# EAGLE design RGB_controller_2zone_v1.00 (EAGLE 8.1.0)
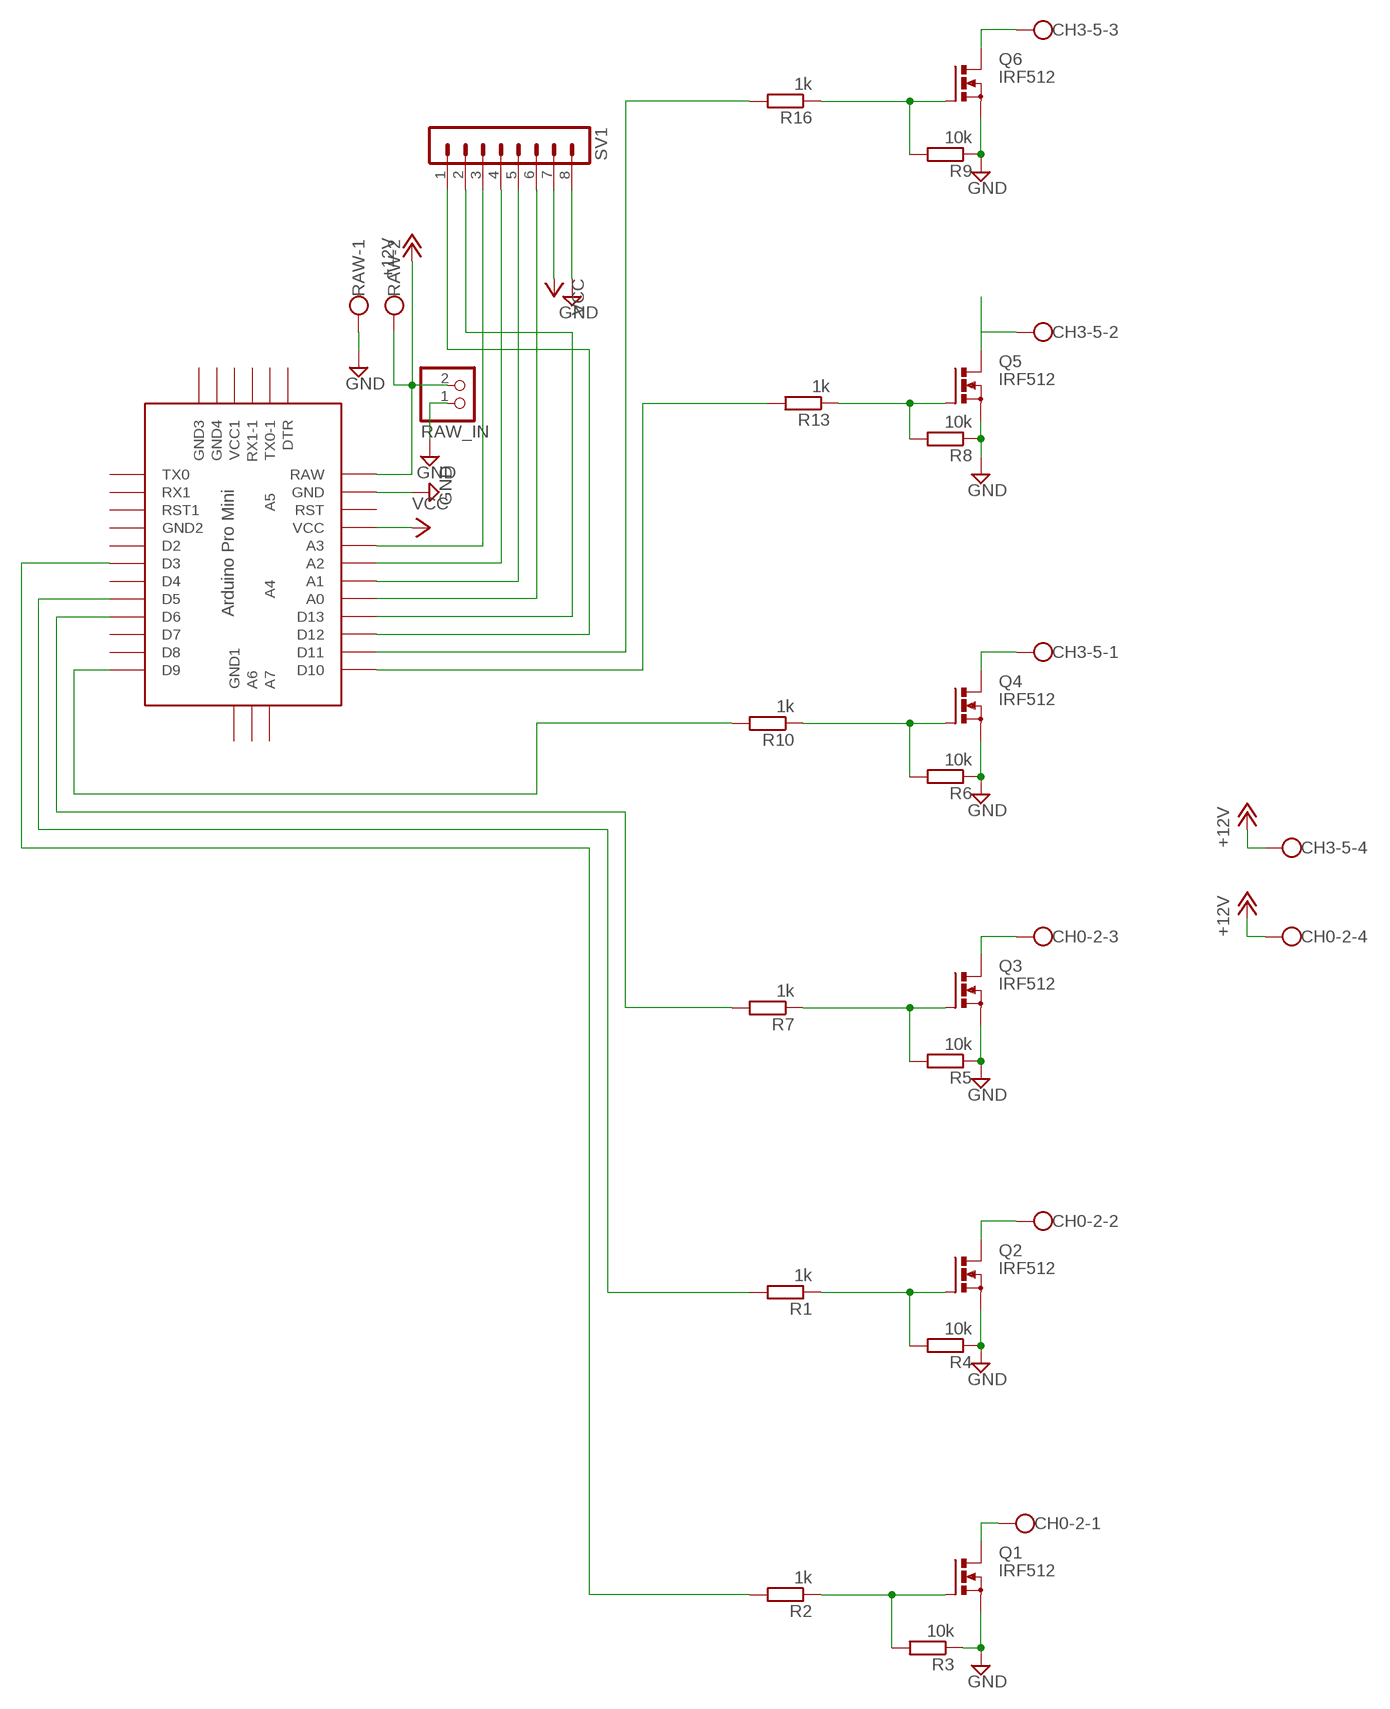
[diagram p0: schematic, sheet 1]

## Parts
CH0-2  W237-4  [W237-4]
CH3-5  W237-4  [W237-4]
Q1  IRF512  [TO220BV]
Q2  IRF512  [TO220BV]
Q3  IRF512  [TO220BV]
Q4  IRF512  [TO220BV]
Q5  IRF512  [TO220BV]
Q6  IRF512  [TO220BV]
R1  1k  R-EU_0207/10  [0207/10]
R2  1k  R-EU_0207/10  [0207/10]
R3  10k  R-EU_0207/10  [0207/10]
R4  10k  R-EU_0207/10  [0207/10]
R5  10k  R-EU_0207/10  [0207/10]
R6  10k  R-EU_0207/10  [0207/10]
R7  1k  R-EU_0207/10  [0207/10]
R8  10k  R-EU_0207/10  [0207/10]
R9  10k  R-EU_0207/10  [0207/10]
R10  1k  R-EU_0207/10  [0207/10]
R13  1k  R-EU_0207/10  [0207/10]
R16  1k  R-EU_0207/10  [0207/10]
RAW  W237-102  [W237-102]
RAW_IN  PINHD-1X2  [1X02]
SV1  MA08-1  [MA08-1]
U$1  ABK-PRO-MINI  [ABK-PRO-MINI]

## Nets
+12V: CH0-2.4 CH3-5.4 RAW.2 RAW_IN.2 U$1.RAW
A0: SV1.6 U$1.A0
A1: SV1.5 U$1.A1
A2: SV1.4 U$1.A2
A3: SV1.3 U$1.A3
D12: SV1.1 U$1.D12
D13: SV1.2 U$1.D13
GATE_1: Q1.G R2.1 R3.2
GATE_2: Q2.G R1.1 R4.2
GATE_3: Q3.G R5.2 R7.1
GATE_4: Q4.G R6.2 R10.1
GATE_5: Q5.G R8.2 R13.1
GATE_6: Q6.G R9.2 R16.1
GND: Q1.S Q2.S Q3.S Q4.S Q5.S Q6.S R3.1 R4.1 R5.1 R6.1 R8.1 R9.1 RAW.1 RAW_IN.1 SV1.8 U$1.GND
IC_PWM_OUT_0: R2.2 U$1.D3
IC_PWM_OUT_1: R1.2 U$1.D5
IC_PWM_OUT_2: R7.2 U$1.D6
IC_PWM_OUT_3: R10.2 U$1.D9
IC_PWM_OUT_4: R13.2 U$1.D10
IC_PWM_OUT_5: R16.2 U$1.D11
OUTPUT_0: CH0-2.1 Q1.D
OUTPUT_1: CH0-2.2 Q2.D
OUTPUT_2: CH0-2.3 Q3.D
OUTPUT_3: CH3-5.1 Q4.D
OUTPUT_4: CH3-5.2 Q5.D
OUTPUT_5: CH3-5.3 Q6.D
VCC: SV1.7 U$1.VCC
Unconnected: U$1.A4 U$1.A5 U$1.A6 U$1.A7 U$1.D2 U$1.D4 U$1.D7 U$1.D8 U$1.DTR U$1.GND1(GND2) U$1.GND2(GND3) U$1.GND3(GND4) U$1.GND4(GND1) U$1.RST U$1.RST1 U$1.RX1 U$1.RX1-1 U$1.TX0 U$1.TX0-1 U$1.VCC1

## Library data of the parts
CH0-2 CH3-5 = con-wago-500:W237-4: WAGO SCREW CLAMP; OC_FARNELL: unknown; OC_NEWARK: unknown
Q1-Q6 = transistor-power:IRF512: N-CHANNEL MOS FET
R1-R10 R13 R16 = rcl:R-EU_: RESISTOR, European symbol
RAW = con-wago-500:W237-102: WAGO SCREW CLAMP; MPN: 237-102; OC_FARNELL: unknown; OC_NEWARK: 70K9898
RAW_IN = pinhead:PINHD-1X2: PIN HEADER
SV1 = con-lstb:MA08-1: PIN HEADER; OC_FARNELL: unknown; OC_NEWARK: unknown
U$1 = Arduino-clone:ABK-PRO-MINI: ABK Pro-Mini Arduino Clone

## Board
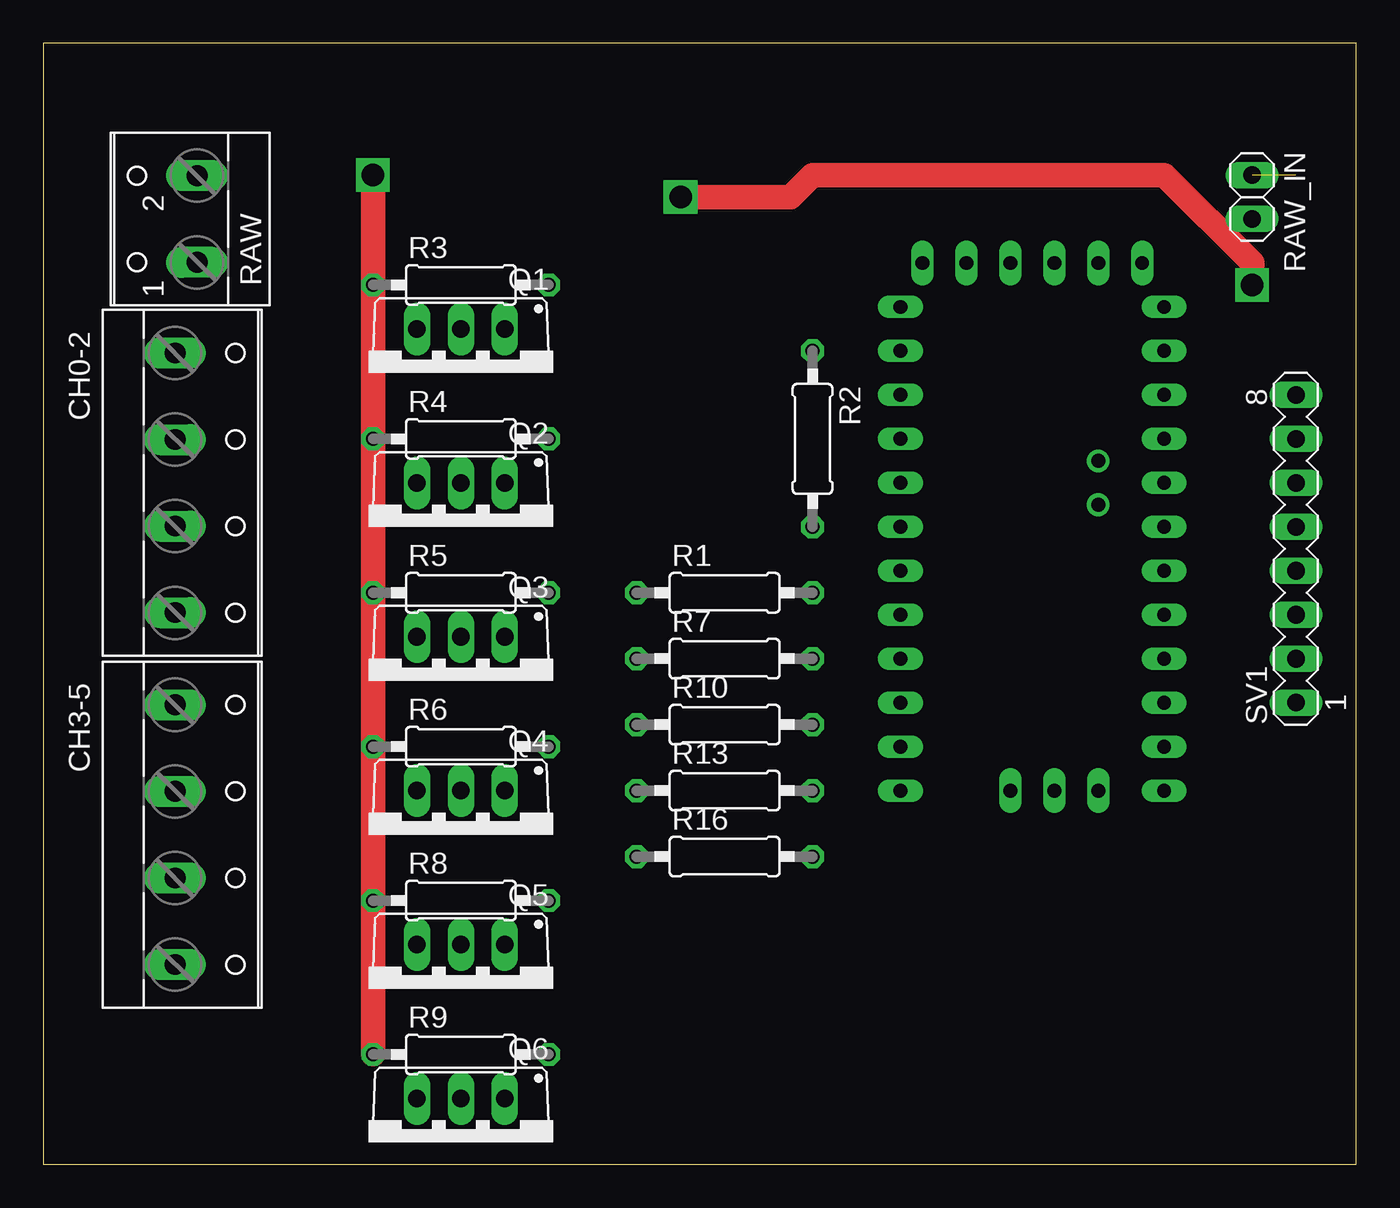
[diagram p1: board, top side]
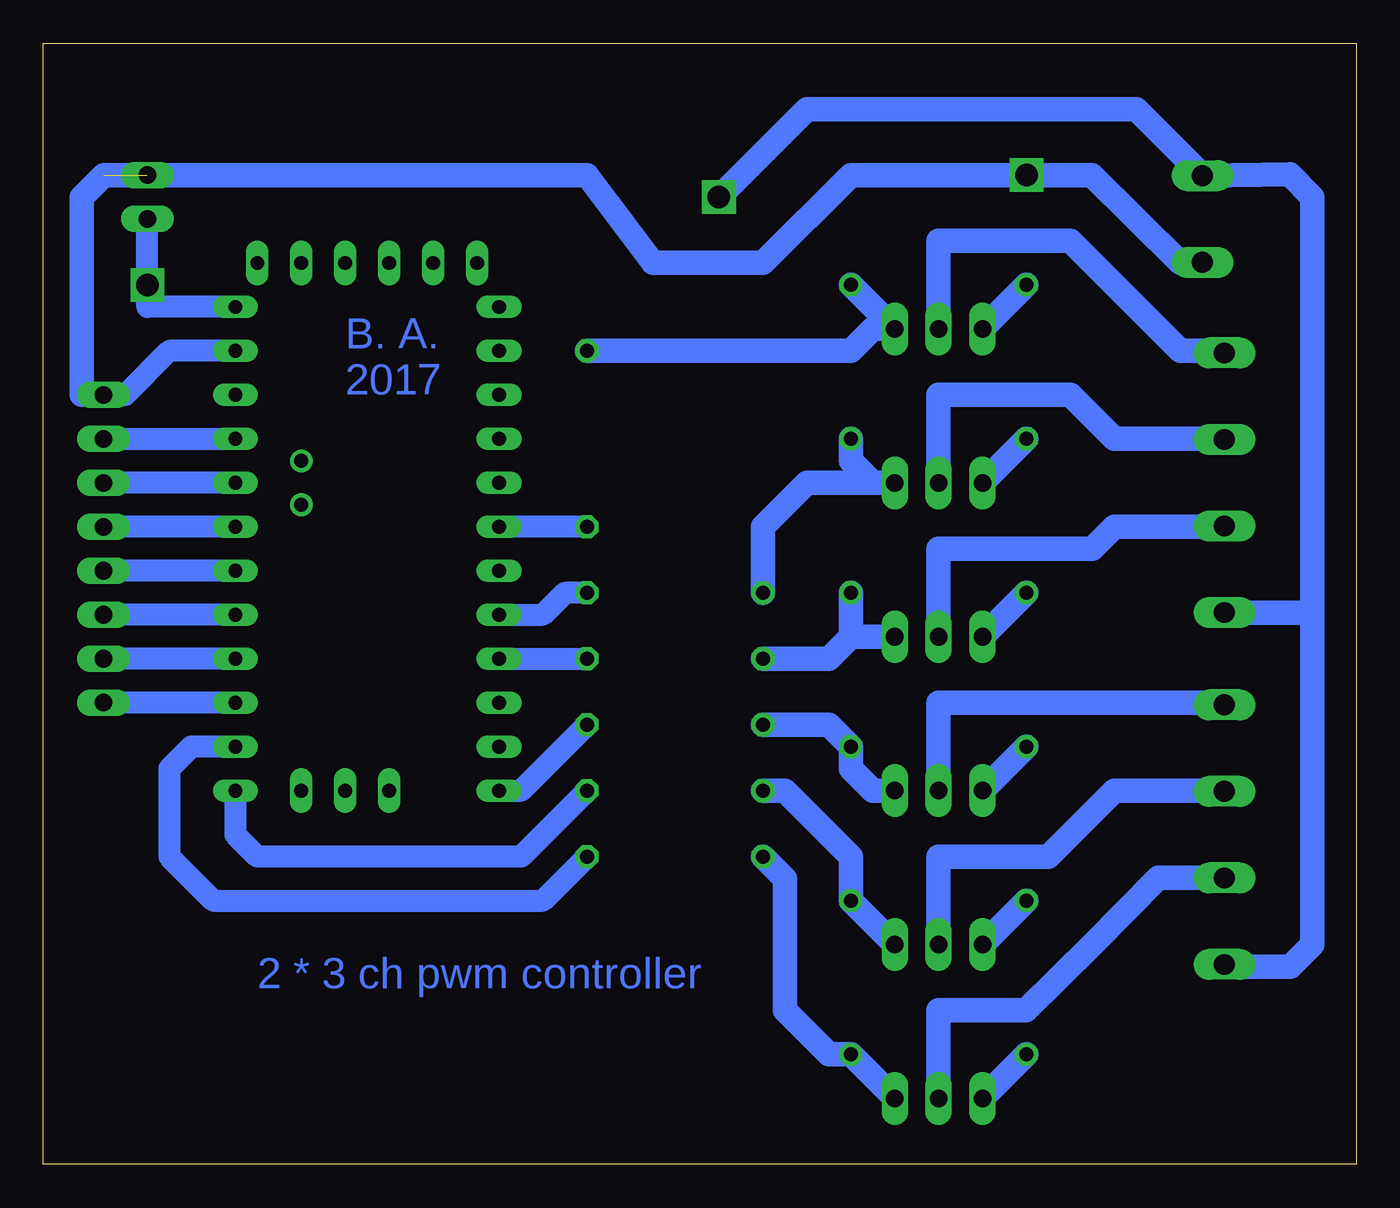
[diagram p2: board, bottom side, seen from below]

Size 75.87 x 64.76 mm. Coordinates in mm from the lower left corner, seen from the top.
Outline: 0,0 75.87,0 75.87,64.76 0,64.76 0,0
Copper layers (1*16): Top 0.035mm / dielectric 1.5mm / Bottom 0.035mm
Design rules "default": minimum track width 10mil, minimum drill 24mil, track to track 8mil, track to pad 8mil, pad to pad 8mil, via to via 8mil, smd to smd 8mil, copper to edge 40mil, drill to drill 8mil, minimum pad ring 10mil, minimum via ring 8mil, stop-mask expansion 4mil, vias tented up to drill 0mil, thermal gap 10mil

### Footprints (pad centres in the part's own frame; a part is rotated, then mirrored left to right if it is on the bottom)
W237-4 = drill 1.194 long: 1 -7.5,-1.27; 2 -2.5,-1.27; 3 2.5,-1.27; 4 7.5,-1.27
TO220BV = drill 1.016 long: D 0,-2.54; G -2.54,-2.54; S 2.54,-2.54
0207/10 = drill 0.813 octagon: 1 -5.08,0; 2 5.08,0
W237-102 = drill 1.194 long: 1 -2.5,-1.27; 2 2.5,-1.27
1X02 = drill 1.016 long: 1 -1.27,0; 2 1.27,0
MA08-1 = drill 1.016 long: 1 -8.89,0; 2 -6.35,0; 3 -3.81,0; 4 -1.27,0; 5 1.27,0; 6 3.81,0; 7 6.35,0; 8 8.89,0
ABK-PRO-MINI = drill 0.8 long: A0 10.16,-3.81; A1 10.16,-6.35; A2 10.16,-8.89; A3 10.16,-11.43; A6 3.81,-21.59; A7 6.35,-21.59; D2 -5.08,-3.81; D3 -5.08,-6.35; D4 -5.08,-8.89; D5 -5.08,-11.43; D6 -5.08,-13.97; D7 -5.08,-16.51; D8 -5.08,-19.05; D9 -5.08,-21.59; D10 10.16,-21.59; D11 10.16,-19.05; D12 10.16,-16.51; D13 10.16,-13.97; DTR 8.89,8.89; GND 10.16,3.81; GND1 -5.08,-1.27; GND2 -3.81,8.89; GND3 -1.27,8.89; GND4 1.27,-21.59; RAW 10.16,6.35; RST 10.16,1.27; RST1 -5.08,1.27; RX1 -5.08,3.81; RX1-1 3.81,8.89; TX0 -5.08,6.35; TX0-1 6.35,8.89; VCC 10.16,-1.27; VCC1 1.27,8.89 | drill 0.8: A4 6.35,-5.08; A5 6.35,-2.54

### Placement (x,y rotation side)
CH0-2  8.89,39.37 270 top
CH3-5  8.89,19.05 270 top
Q1  24.13,45.72 180 top
Q2  24.13,36.83 180 top
Q3  24.13,27.94 180 top
Q4  24.13,19.05 180 top
Q5  24.13,10.16 180 top
Q6  24.13,1.27 180 top
R1  39.37,33.02 0 top
R2  44.45,41.91 270 top
R3  24.13,50.8 0 top
R4  24.13,41.91 0 top
R5  24.13,33.02 0 top
R6  24.13,24.13 0 top
R7  39.37,29.21 0 top
R8  24.13,15.24 0 top
R9  24.13,6.35 0 top
R10  39.37,25.4 0 top
R13  39.37,21.59 0 top
R16  39.37,17.78 0 top
RAW  7.62,54.61 90 top
RAW_IN  69.85,55.88 270 top
SV1  72.39,35.56 90 top
U$1  54.61,43.18 0 top

### Tracks (layer width: path | path; a pad name or v marks a point on that pad's centre or on a via)
+12V  (via drill 1.3)
  Top 1.422: v36.83,55.88 43.18,55.88 44.45,57.15 64.77,57.15 69.85,52.07 v69.85,50.8
  Bottom 1.27: RAW_IN.2 v69.85,50.8 69.85,49.53 U$1.RAW
  Bottom 1.422: 2.54,31.75 2.54,55.88 3.85,57.19 RAW.2 8.89,57.15 12.7,60.96 31.75,60.96 v36.83,55.88 | 2.54,31.75 2.54,12.7 3.81,11.43 7.5,11.43 CH3-5.4 | CH0-2.4 2.66,31.87 2.54,31.75
A0
  Bottom 1.27: U$1.A0 SV1.6
A1
  Bottom 1.27: U$1.A1 SV1.5
A2
  Bottom 1.27: U$1.A2 SV1.4
A3
  Bottom 1.27: U$1.A3 SV1.3
D12
  Bottom 1.27: U$1.D12 SV1.1
D13
  Bottom 1.27: U$1.D13 SV1.2
GATE_1
  Bottom 1.422: R3.2 Q1.G 27.94,48.26 29.21,46.99 R2.1
GATE_2
  Bottom 1.422: R4.2 29.21,40.64 27.94,39.37 | 27.94,39.37 Q2.G | R1.1 34.29,36.83 31.75,39.37 27.94,39.37
GATE_3
  Bottom 1.422: R7.1 30.48,29.21 29.21,30.48 | 29.21,30.48 Q3.G | R5.2 29.21,30.48
GATE_4
  Bottom 1.422: R10.1 30.48,25.4 R6.2 29.21,22.86 27.94,21.59 Q4.G
GATE_5
  Bottom 1.422: R13.1 33.02,21.59 29.21,17.78 R8.2 Q5.G
GATE_6
  Bottom 1.422: Q6.G R9.2 30.48,6.35 33.02,8.89 33.02,16.51 R16.1
GND  (via drill 1.3)  (1 unrouted)
  Top 1.422: R9.1 R8.1 R6.1 R5.1 R4.1 R3.1 v19.05,57.15
  Bottom 1.27: 71.12,44.45 68.58,46.99 U$1.GND | 71.12,44.45 73.66,44.45 | SV1.8 71.12,44.45
  Bottom 1.422: Q1.S R3.1 | Q4.S R6.1 | Q5.S R8.1 | Q6.S R9.1 | Q3.S R5.1 | Q2.S R4.1 | RAW.1 10.16,52.11 10.16,52.07 15.28,57.15 v19.05,57.15 29.21,57.15 34.29,52.07 40.64,52.07 44.45,57.15 72.39,57.15 73.66,55.88 73.66,44.45
IC_PWM_OUT_0
  Bottom 1.27: R2.2 U$1.D3
IC_PWM_OUT_1
  Bottom 1.27: R1.2 45.72,33.02 46.99,31.75 U$1.D5
IC_PWM_OUT_2
  Bottom 1.27: U$1.D6 R7.2
IC_PWM_OUT_3
  Bottom 1.27: 48.26,21.59 R10.2 48.26,21.59 | U$1.D9 48.26,21.59
IC_PWM_OUT_4
  Bottom 1.27: R13.2 48.26,17.78 63.5,17.78 64.77,19.05 U$1.D10
IC_PWM_OUT_5
  Bottom 1.27: R16.2 46.99,15.24 66.04,15.24 68.58,17.78 68.58,22.86 67.31,24.13 U$1.D11
OUTPUT_0
  Bottom 1.422: Q1.D 24.13,53.34 16.51,53.34 10.16,46.99 7.74,46.99 CH0-2.1
OUTPUT_1
  Bottom 1.422: Q2.D 24.13,44.45 16.51,44.45 13.97,41.91 7.66,41.91 CH0-2.2
OUTPUT_2
  Bottom 1.422: Q3.D 24.13,35.56 15.24,35.56 13.97,36.83 7.66,36.83 CH0-2.3
OUTPUT_3
  Bottom 1.422: Q4.D 24.13,26.67 7.74,26.67 CH3-5.1
OUTPUT_4
  Bottom 1.422: Q5.D 24.13,17.78 17.78,17.78 13.97,21.59 7.66,21.59 CH3-5.2
OUTPUT_5
  Bottom 1.422: Q6.D 24.13,8.89 19.09,8.89 15.24,12.7 11.43,16.55 CH3-5.3
VCC
  Bottom 1.27: SV1.7 U$1.VCC

### Text on the board
Bottom: B. A. / 2017 | 2 * 3 ch pwm controller